# EAGLE design node (EAGLE 9.6.2)
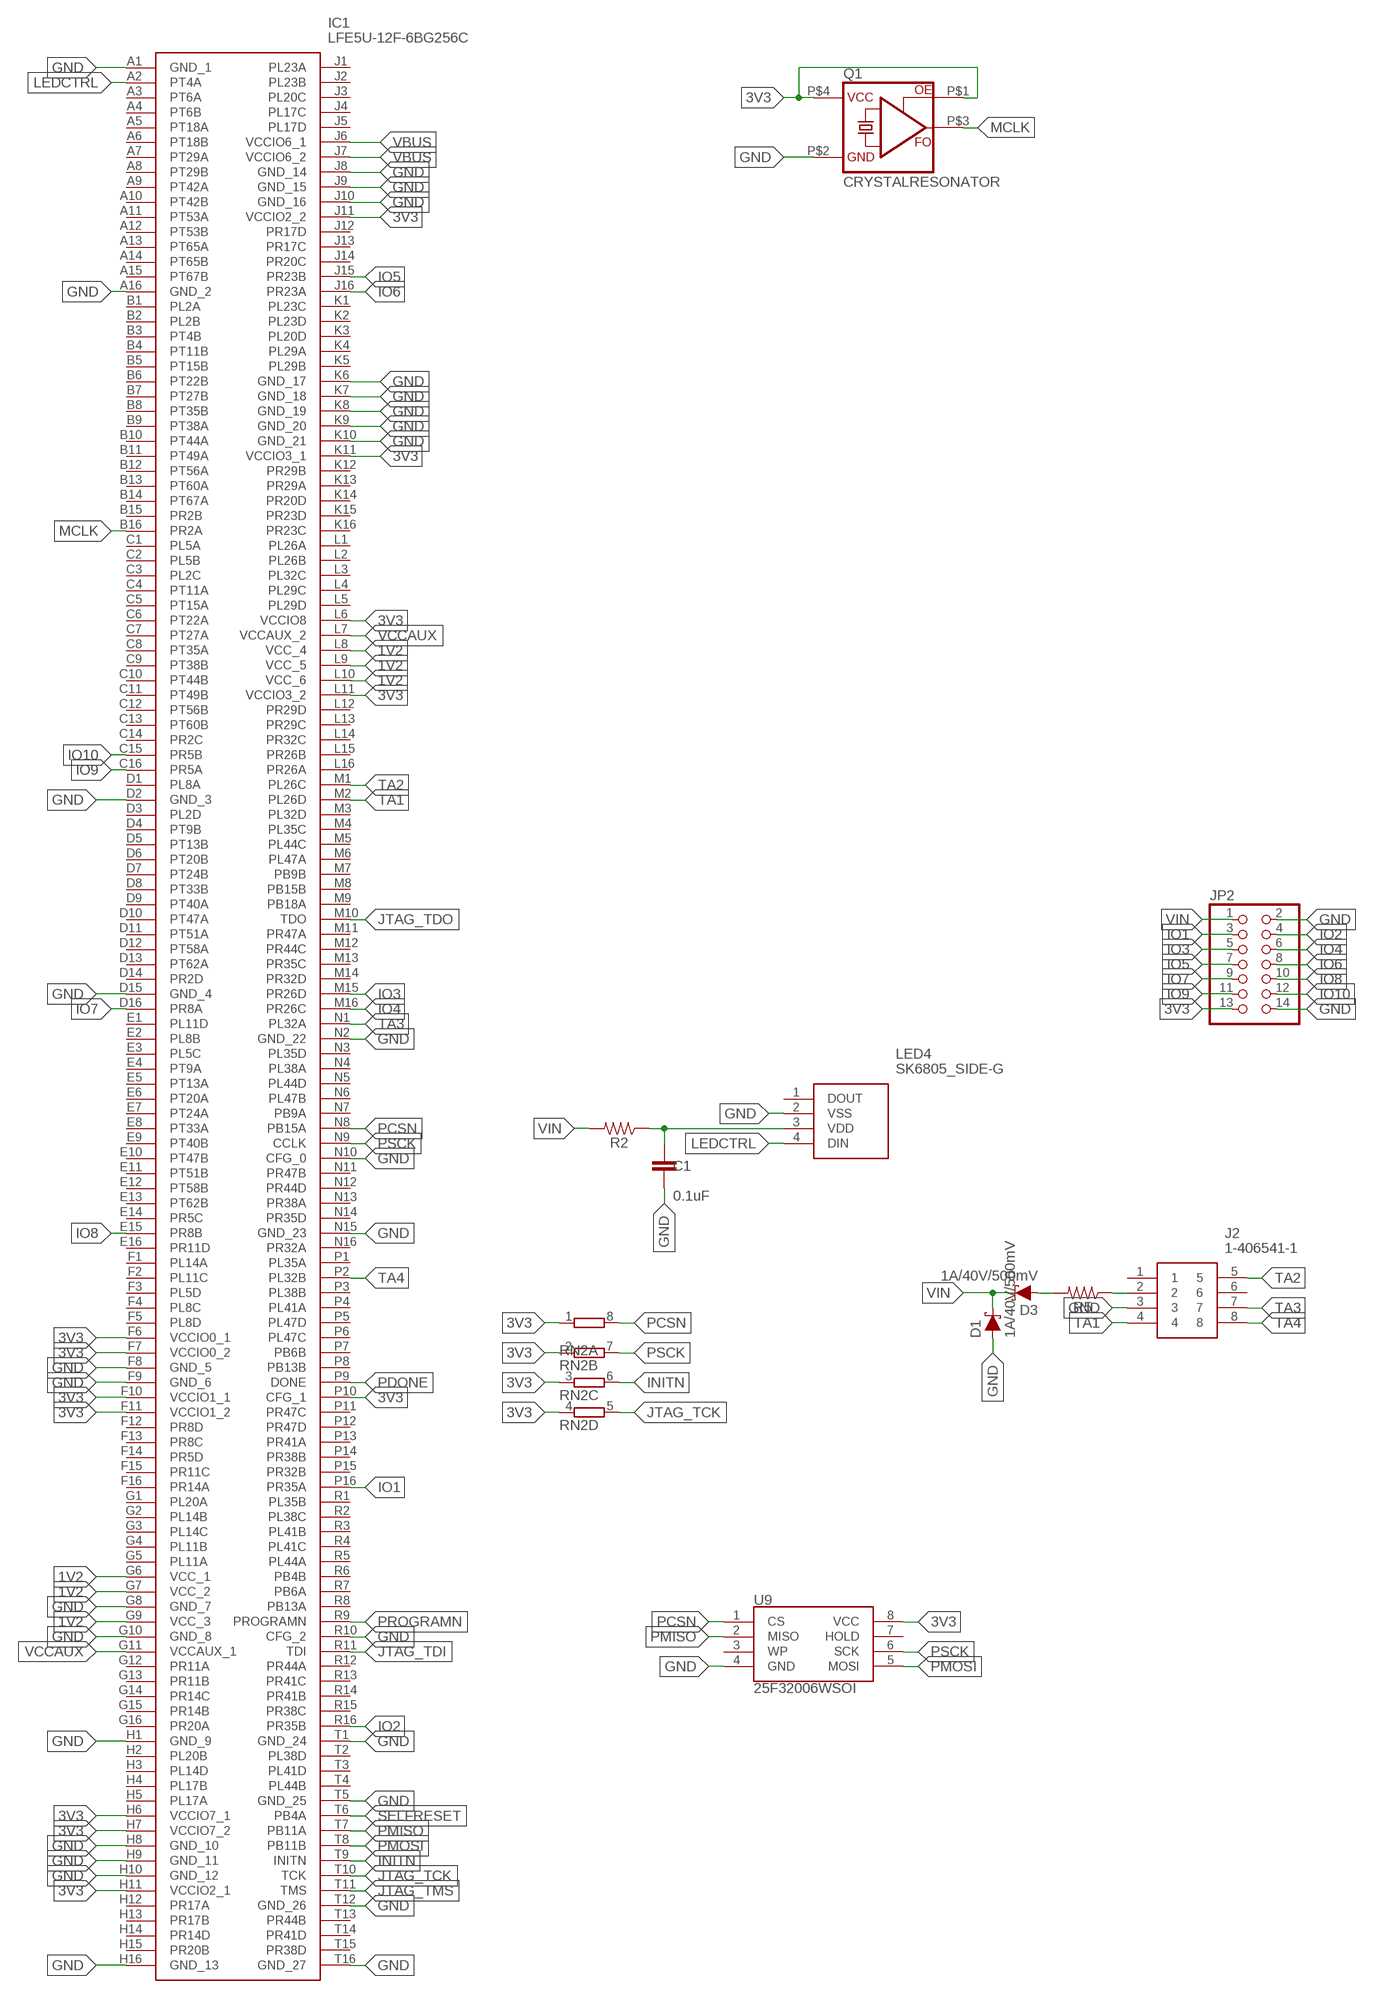
[diagram p0: schematic, sheet 1, part 1 of 2]
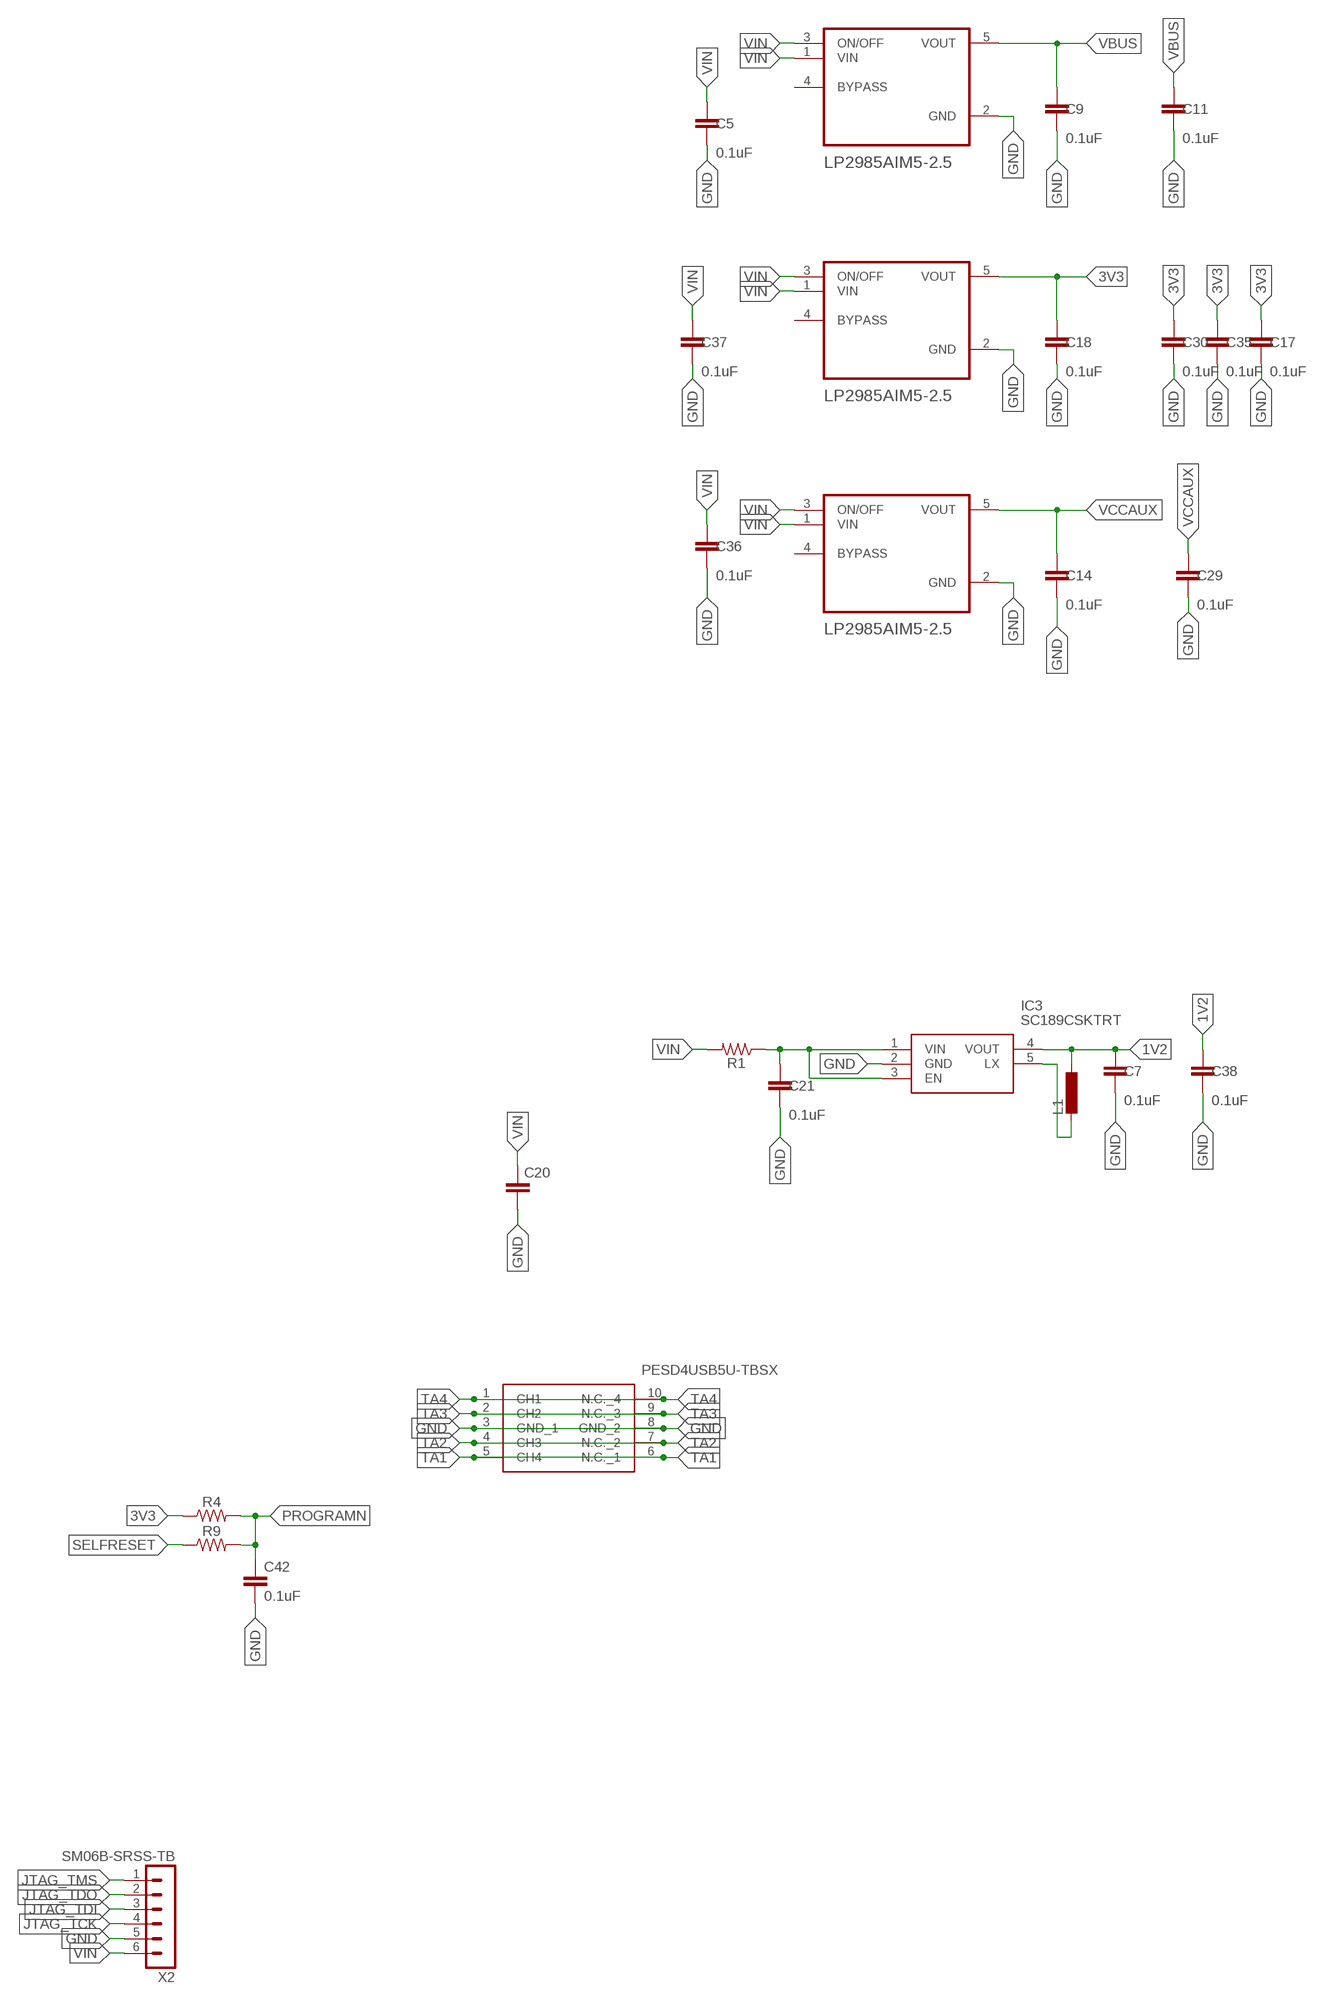
[diagram p1: schematic, sheet 1, part 2 of 2]

## Parts
C1  0.1uF  0.1UF-0603-25V-5%  [0603]
C5  0.1uF  0.1UF-0603-25V-5%  [0603]
C7  0.1uF  0.1UF-0603-25V-5%  [0603]
C9  0.1uF  0.1UF-0603-25V-5%  [0603]
C11  0.1uF  0.1UF-0603-25V-5%  [0603]
C14  0.1uF  0.1UF-0603-25V-5%  [0603]
C17  0.1uF  0.1UF-0603-25V-5%  [0603]
C18  0.1uF  0.1UF-0603-25V-5%  [0603]
C20  C-EUC1812  [C1812]
C21  0.1uF  0.1UF-0603-25V-5%  [0603]
C29  0.1uF  0.1UF-0603-25V-5%  [0603]
C30  0.1uF  0.1UF-0603-25V-5%  [0603]
C35  0.1uF  0.1UF-0603-25V-5%  [0603]
C36  0.1uF  0.1UF-0603-25V-5%  [0603]
C37  0.1uF  0.1UF-0603-25V-5%  [0603]
C38  0.1uF  0.1UF-0603-25V-5%  [0603]
C42  0.1uF  0.1UF-0603-25V-5%  [0603]
D1  1A/40V/500mV  DIODE-SCHOTTKY-SS14  [SMA-DIODE]
D3  1A/40V/500mV  DIODE-SCHOTTKY-SS14  [SMA-DIODE]
D10  PESD4USB5U-TBSX  [SON50P100X250X80-10N]
IC1  LFE5U-12F-6BG256C  [BGA256C80P16X16_1400X1400X170]
IC3  SC189CSKTRT  [SOT95P280X145-5N]
J2  1-406541-1  [1-406541-1_1]
JP2  PINHD-2X7  [2X07]
L1  L-EUL3230M  [L3230M]
LED4  SK6805_SIDE-G  [SK6805SIDEG]
Q1  CRYSTALRESONATOR  [XO53X]
R1  RESISTOR0603  [0603]
R2  RESISTOR0603  [0603]
R4  RESISTOR0603  [0603]
R5  RESISTOR0805  [0805]
R9  RESISTOR0603  [0603]
RN2  4R-NEXBV8V  [EXBV8V]
U1  LP2985AIM5-2.5  [SOT95P280X145-5N]
U2  LP2985AIM5-2.5  [SOT95P280X145-5N]
U6  LP2985AIM5-2.5  [SOT95P280X145-5N]
U9  25F32006WSOI  SPI_FLASH-X25XXSMD1  [SO08-EIAJ]
X2  SM06B-SRSS-TB  [SM06B-SRSS-TB]

## Nets
1V2: C7.1 C38.1 IC1.G6(VCC_1) IC1.G7(VCC_2) IC1.G9(VCC_3) IC1.L8(VCC_4) IC1.L9(VCC_5) IC1.L10(VCC_6) IC3.4(VOUT) L1.1
3V3: C17.1 C18.1 C30.1 C35.1 IC1.F6(VCCIO0_1) IC1.F7(VCCIO0_2) IC1.F10(VCCIO1_1) IC1.F11(VCCIO1_2) IC1.H6(VCCIO7_1) IC1.H7(VCCIO7_2) IC1.H11(VCCIO2_1) IC1.J11(VCCIO2_2) IC1.K11(VCCIO3_1) IC1.L6(VCCIO8) IC1.L11(VCCIO3_2) IC1.P10(CFG_1) JP2.13 Q1.P$1(OE) Q1.P$4(VCC) R4.1 RN2.1 RN2.2 RN2.3 RN2.4 U2.5(VOUT) U9.8(VCC)
GND: C1.2 C5.2 C7.2 C9.2 C11.2 C14.2 C17.2 C18.2 C20.2 C21.2 C29.2 C30.2 C35.2 C36.2 C37.2 C38.2 C42.2 D1.A D10.3(GND_1) D10.8(GND_2) IC1.A1(GND_1) IC1.A16(GND_2) IC1.D2(GND_3) IC1.D15(GND_4) IC1.F8(GND_5) IC1.F9(GND_6) IC1.G8(GND_7) IC1.G10(GND_8) IC1.H1(GND_9) IC1.H8(GND_10) IC1.H9(GND_11) IC1.H10(GND_12) IC1.H16(GND_13) IC1.J8(GND_14) IC1.J9(GND_15) IC1.J10(GND_16) IC1.K6(GND_17) IC1.K7(GND_18) IC1.K8(GND_19) IC1.K9(GND_20) IC1.K10(GND_21) IC1.N2(GND_22) IC1.N10(CFG_0) IC1.N15(GND_23) IC1.R10(CFG_2) IC1.T1(GND_24) IC1.T5(GND_25) IC1.T12(GND_26) IC1.T16(GND_27) IC3.2(GND) J2.3 JP2.2 JP2.14 LED4.2(VSS) Q1.P$2(GND) U1.2(GND) U2.2(GND) U6.2(GND) U9.4(GND) X2.5
INITN: IC1.T9(INITN) RN2.6
IO1: IC1.P16(PR35A) JP2.3
IO2: IC1.R16(PR35B) JP2.4
IO3: IC1.M15(PR26D) JP2.5
IO4: IC1.M16(PR26C) JP2.6
IO5: IC1.J15(PR23B) JP2.7
IO6: IC1.J16(PR23A) JP2.8
IO7: IC1.D16(PR8A) JP2.9
IO8: IC1.E15(PR8B) JP2.10
IO9: IC1.C16(PR5A) JP2.11
IO10: IC1.C15(PR5B) JP2.12
JTAG_TCK: IC1.T10(TCK) RN2.5 X2.4
JTAG_TDI: IC1.R11(TDI) X2.3
JTAG_TDO: IC1.M10(TDO) X2.2
JTAG_TMS: IC1.T11(TMS) X2.1
LEDCTRL: IC1.A2(PT4A) LED4.4(DIN)
MCLK: IC1.B16(PR2A) Q1.P$3(FO)
N$1: C1.1 LED4.3(VDD) R2.1
N$3: IC3.5(LX) L1.2
N$5: C21.1 IC3.1(VIN) IC3.3(EN) R1.1
N$6: J2.2 R5.1
N$15: D3.A R5.2
PCSN: IC1.N8(PB15A) RN2.8 U9.1(CS)
PDONE: IC1.P9(DONE)
PMISO: IC1.T7(PB11A) U9.2(MISO)
PMOSI: IC1.T8(PB11B) U9.5(MOSI)
PROGRAMN: C42.1 IC1.R9(PROGRAMN) R4.2 R9.2
PSCK: IC1.N9(CCLK) RN2.7 U9.6(SCK)
SELFRESET: IC1.T6(PB4A) R9.1
TA1: D10.5(CH4) D10.6(N.C._1) IC1.M2(PL26D) J2.4
TA2: D10.4(CH3) D10.7(N.C._2) IC1.M1(PL26C) J2.5
TA3: D10.2(CH2) D10.9(N.C._3) IC1.N1(PL32A) J2.7
TA4: D10.1(CH1) D10.10(N.C._4) IC1.P2(PL32B) J2.8
VBUS: C9.1 C11.1 IC1.J6(VCCIO6_1) IC1.J7(VCCIO6_2) U1.5(VOUT)
VCCAUX: C14.1 C29.1 IC1.G11(VCCAUX_1) IC1.L7(VCCAUX_2) U6.5(VOUT)
VIN: C5.1 C20.1 C36.1 C37.1 D1.C D3.C JP2.1 R1.2 R2.2 U1.1(VIN) U1.3(ON/OFF) U2.1(VIN) U2.3(ON/OFF) U6.1(VIN) U6.3(ON/OFF) X2.6
Unconnected: IC1.A3(PT6A) IC1.A4(PT6B) IC1.A5(PT18A) IC1.A6(PT18B) IC1.A7(PT29A) IC1.A8(PT29B) IC1.A9(PT42A) IC1.A10(PT42B) IC1.A11(PT53A) IC1.A12(PT53B) IC1.A13(PT65A) IC1.A14(PT65B) IC1.A15(PT67B) IC1.B1(PL2A) IC1.B2(PL2B) IC1.B3(PT4B) IC1.B4(PT11B) IC1.B5(PT15B) IC1.B6(PT22B) IC1.B7(PT27B) IC1.B8(PT35B) IC1.B9(PT38A) IC1.B10(PT44A) IC1.B11(PT49A) IC1.B12(PT56A) IC1.B13(PT60A) IC1.B14(PT67A) IC1.B15(PR2B) IC1.C1(PL5A) IC1.C2(PL5B) IC1.C3(PL2C) IC1.C4(PT11A) IC1.C5(PT15A) IC1.C6(PT22A) IC1.C7(PT27A) IC1.C8(PT35A) IC1.C9(PT38B) IC1.C10(PT44B) IC1.C11(PT49B) IC1.C12(PT56B) IC1.C13(PT60B) IC1.C14(PR2C) IC1.D1(PL8A) IC1.D3(PL2D) IC1.D4(PT9B) IC1.D5(PT13B) IC1.D6(PT20B) IC1.D7(PT24B) IC1.D8(PT33B) IC1.D9(PT40A) IC1.D10(PT47A) IC1.D11(PT51A) IC1.D12(PT58A) IC1.D13(PT62A) IC1.D14(PR2D) IC1.E1(PL11D) IC1.E2(PL8B) IC1.E3(PL5C) IC1.E4(PT9A) IC1.E5(PT13A) IC1.E6(PT20A) IC1.E7(PT24A) IC1.E8(PT33A) IC1.E9(PT40B) IC1.E10(PT47B) IC1.E11(PT51B) IC1.E12(PT58B) IC1.E13(PT62B) IC1.E14(PR5C) IC1.E16(PR11D) IC1.F1(PL14A) IC1.F2(PL11C) IC1.F3(PL5D) IC1.F4(PL8C) IC1.F5(PL8D) IC1.F12(PR8D) IC1.F13(PR8C) IC1.F14(PR5D) IC1.F15(PR11C) IC1.F16(PR14A) IC1.G1(PL20A) IC1.G2(PL14B) IC1.G3(PL14C) IC1.G4(PL11B) IC1.G5(PL11A) IC1.G12(PR11A) IC1.G13(PR11B) IC1.G14(PR14C) IC1.G15(PR14B) IC1.G16(PR20A) IC1.H2(PL20B) IC1.H3(PL14D) IC1.H4(PL17B) IC1.H5(PL17A) IC1.H12(PR17A) IC1.H13(PR17B) IC1.H14(PR14D) IC1.H15(PR20B) IC1.J1(PL23A) IC1.J2(PL23B) IC1.J3(PL20C) IC1.J4(PL17C) IC1.J5(PL17D) IC1.J12(PR17D) IC1.J13(PR17C) IC1.J14(PR20C) IC1.K1(PL23C) IC1.K2(PL23D) IC1.K3(PL20D) IC1.K4(PL29A) IC1.K5(PL29B) IC1.K12(PR29B) IC1.K13(PR29A) IC1.K14(PR20D) IC1.K15(PR23D) IC1.K16(PR23C) IC1.L1(PL26A) IC1.L2(PL26B) IC1.L3(PL32C) IC1.L4(PL29C) IC1.L5(PL29D) IC1.L12(PR29D) IC1.L13(PR29C) IC1.L14(PR32C) IC1.L15(PR26B) IC1.L16(PR26A) IC1.M3(PL32D) IC1.M4(PL35C) IC1.M5(PL44C) IC1.M6(PL47A) IC1.M7(PB9B) IC1.M8(PB15B) IC1.M9(PB18A) IC1.M11(PR47A) IC1.M12(PR44C) IC1.M13(PR35C) IC1.M14(PR32D) IC1.N3(PL35D) IC1.N4(PL38A) IC1.N5(PL44D) IC1.N6(PL47B) IC1.N7(PB9A) IC1.N11(PR47B) IC1.N12(PR44D) IC1.N13(PR38A) IC1.N14(PR35D) IC1.N16(PR32A) IC1.P1(PL35A) IC1.P3(PL38B) IC1.P4(PL41A) IC1.P5(PL47D) IC1.P6(PL47C) IC1.P7(PB6B) IC1.P8(PB13B) IC1.P11(PR47C) IC1.P12(PR47D) IC1.P13(PR41A) IC1.P14(PR38B) IC1.P15(PR32B) IC1.R1(PL35B) IC1.R2(PL38C) IC1.R3(PL41B) IC1.R4(PL41C) IC1.R5(PL44A) IC1.R6(PB4B) IC1.R7(PB6A) IC1.R8(PB13A) IC1.R12(PR44A) IC1.R13(PR41C) IC1.R14(PR41B) IC1.R15(PR38C) IC1.T2(PL38D) IC1.T3(PL41D) IC1.T4(PL44B) IC1.T13(PR44B) IC1.T14(PR41D) IC1.T15(PR38D) J2.1 J2.6 LED4.1(DOUT) U1.4(BYPASS) U2.4(BYPASS) U6.4(BYPASS) U9.3(WP) U9.7(HOLD)

## Library data of the parts
C1 C5 C7 C9 C11 C14 C17 C18 C21 C29 C30 C35-C38 C42 = SparkFun-Capacitors:0.1UF: 0.1µF ceramic capacitors A capacitor is a passive two-terminal electrical component used to store electrical energy temporarily in an electric field.; PROD_ID: CAP-08604
C20 = rcl:C-EU: CAPACITOR, European symbol; SPICEPREFIX: C
D1 D3 = SparkFun-DiscreteSemi:DIODE-SCHOTTKY: Schottky diode A Schottky diode is a semiconductor diode which has a low forward voltage drop and a very fast switching action.; PROD_ID: DIO-08053
D10 = PESD4USB5U-TBSX:PESD4USB5U-TBSX: ESD Suppressors / TVS Diodes TVS DIODES Source: Datasheet <https://assets.nexperia.com/documents/data-sheet/PESD4USB5U-TBS.pdf>; DESCRIPTION: ESD Suppressors / TVS Diodes TVS DIODES; HEIGHT: 0.8mm; MANUFACTURER_NAME: Nexperia; MANUFACTURER_PART_NUMBER: PESD4USB5U-TBSX; MOUSER_PART_NUMBER: 771-PESD4USB5U-TBSX; MOUSER_PRICE-STOCK: https://www.mouser.co.uk/ProductDetail/Nexperia/PESD4USB5U-TBSX?qs=ljCeji4nMDmlBRiGiyUt1A%3D%3D
IC1 = LFE5U-12F-6BG256C:LFE5U-12F-6BG256C: FPGA - Field Programmable Gate Array ECP5; 12k LUTs; 1.1V Source: Datasheet <http://www.latticesemi.com/-/media/LatticeSemi/Documents/DataSheets/ECP5/FPGA-DS-02012-1-9-ECP5-ECP5G-Family-Data-Sheet.ashx?document_id=50461> Check prices <https://pricing.snapeda.com/parts/LFE5U-12F-6BG256C/Lattice%20Semiconductor/view-part?ref=eda>; AVAILABILITY: Warning; DESCRIPTION: ECP5 Field Programmable Gate Array (FPGA) IC 197 589824 12000 256-LFBGA; MF: Lattice Semiconductor; MP: LFE5U-12F-6BG256C; PACKAGE: CABGA-256 Lattice Semiconductor; PRICE: None; PURCHASE-URL: https://pricing.snapeda.com/search/part/LFE5U-12F-6BG256C/?ref=eda
IC3 = SC189CSKTRT:SC189CSKTRT: Conv DC-DC 2.9V to 5.5V Synchronous Step Down Single-Out 1.2V 1.5A 6-Pin MLPD-UT T/R Source: Datasheet <https://datasheet.datasheetarchive.com/originals/distributors/Datasheets-DGA14/1272982.pdf>; ARROW_PART_NUMBER: SC189CSKTRT; ARROW_PRICE-STOCK: https://www.arrow.com/en/products/sc189csktrt/semtech; DESCRIPTION: Conv DC-DC 2.9V to 5.5V Synchronous Step Down Single-Out 1.2V 1.5A 6-Pin MLPD-UT T/R; HEIGHT: 1.45mm; MANUFACTURER_NAME: SEMTECH; MANUFACTURER_PART_NUMBER: SC189CSKTRT; MOUSER_PART_NUMBER: 947-SC189CSKTRT; MOUSER_PRICE-STOCK: https://www.mouser.co.uk/ProductDetail/Semtech/SC189CSKTRT?qs=rBWM4%252BvDhIcKNVCFfiXT%2Fw%3D%3D
J2 = 1-406541-1:1-406541-1: ModJack,RightAngle,8Position,Cat5 TE Connectivity Female Cat5 RJ45 Connector, Right Angle, Through Hole Mount, Source: Datasheet <http://uk.rs-online.com/web/p/products/7820823>; ARROW_PART_NUMBER: 1-406541-1; ARROW_PRICE-STOCK: https://www.arrow.com/en/products/1-406541-1/te-connectivity?region=europe; DESCRIPTION: ModJack,RightAngle,8Position,Cat5 TE Connectivity Female Cat5 RJ45 Connector, Right Angle, Through Hole Mount,; HEIGHT: mm; MANUFACTURER_NAME: TE Connectivity; MANUFACTURER_PART_NUMBER: 1-406541-1; MOUSER_PART_NUMBER: 571-1-406541-1; MOUSER_PRICE-STOCK: https://www.mouser.co.uk/ProductDetail/TE-Connectivity/1-406541-1?qs=dOAuEKQrqY4XW9msRoSnqA%3D%3D
JP2 = pinhead:PINHD-2X7: PIN HEADER
L1 = rcl:L-EU: INDUCTOR, European symbol; SPICEPREFIX: L
LED4 = SK6805_SIDE-G:SK6805_SIDE-G: SIDE-G 3512 LED Source: Datasheet <https://drive.google.com/file/d/14zRGkHF65mb-kswuIYE0wuO3upQk3szr/view?usp=sharing>; DESCRIPTION: SIDE-G 3512 LED; HEIGHT: 1.3mm; MANUFACTURER_NAME: Shenzhen Normand Electronic; MANUFACTURER_PART_NUMBER: SK6805 SIDE-G
Q1 = Crystals-new:CRYSTALRESONATOR
R1 R2 R4 R5 R9 = SparkFun-Resistors:RESISTOR: Generic Resistor Package
RN2 = resistor-dil:4R-N: Array Chip Resistor Source: RS Component / Phycomp; OC_FARNELL: unknown; OC_NEWARK: unknown
U1 U2 U6 = LP2985AIM5-2.5:LP2985AIM5-2.5: Check prices <https://pricing.snapeda.com/parts/LP2985AIM5-2.5/NOPB/Texas%20Instruments/view-part?ref=eda>; AVAILABILITY: In Stock; DESCRIPTION: 150-mA, 16-V, low-dropout voltage regulator with enable 5-SOT-23 -40 to 125; MF: Texas Instruments; MP: LP2985AIM5-2.5/NOPB; PACKAGE: SOT-23-5 Texas Instruments; PRICE: None; PURCHASE-URL: https://pricing.snapeda.com/search/part/LP2985AIM5-2.5/NOPB/?ref=eda
U9 = SparkFun-IC-Memory:SPI_FLASH-X25XX: 32M Serial Flash Memory 8pin SPI Flash series x25xx. Works with devices like W25X32 and BR25L32 Datasheet <http://www.macronix.com/Lists/Datasheet/Attachments/5031/MX25L3206E,%203V,%2032Mb,%20v1.5.pdf> SparkFun Products SparkFun Venus GPS Logger <https://www.sparkfun.com/products/10920> (GPS-10920); PROD_ID: IC-09109
X2 = con-JST SH (2):SM06B-SRSS: JST SH series header 1.00mm pitch disconnectable crimp style connectors, horizontal (side entry type), 6 pins

## Board
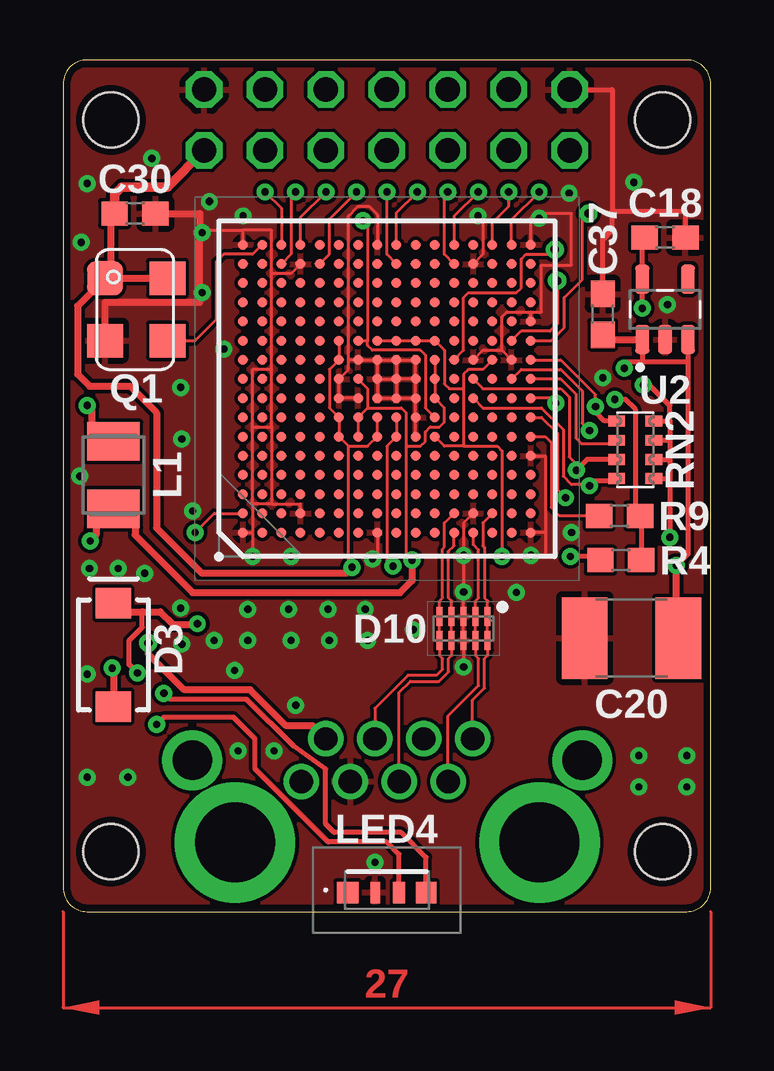
[diagram p2: board, top side]
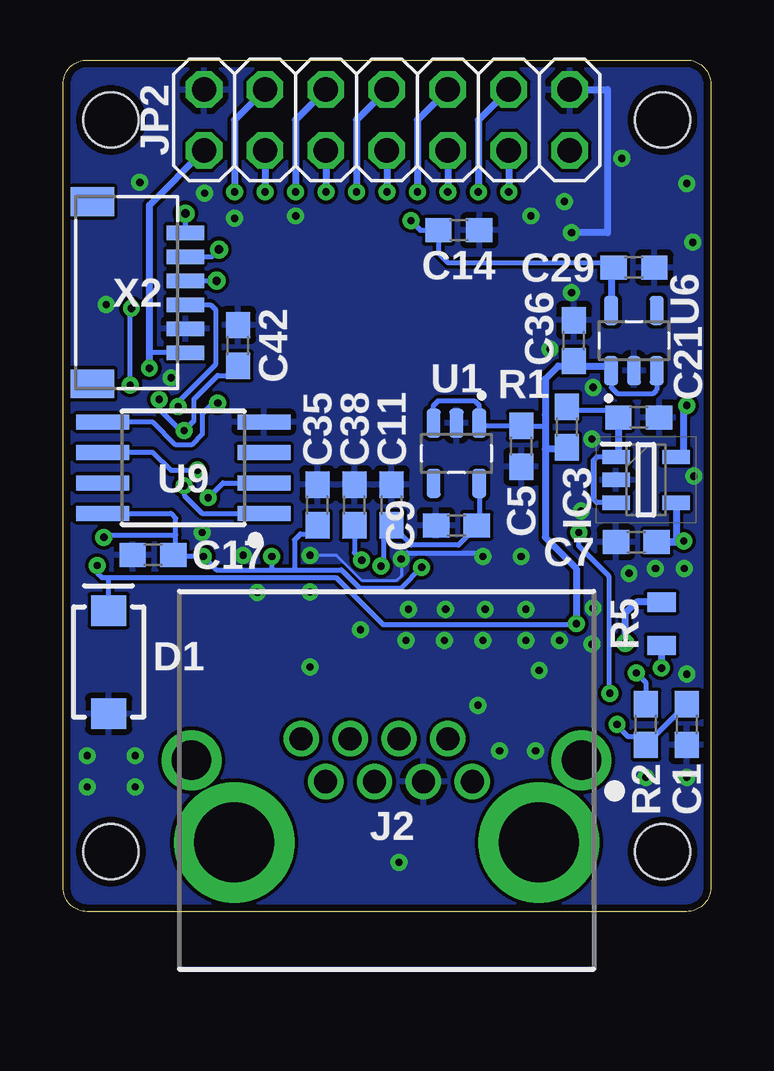
[diagram p3: board, bottom side, seen from below]

Size 27 x 35.5 mm. Coordinates in mm from the lower left corner, seen from the top.
Outline: 27,1 27,34.5 arc90 26,35.5 1,35.5 arc90 0,34.5 0,1 arc90 1,0 26,0 arc90 27,1
Copper layers (1*16): Top 0.035mm / dielectric 1.5mm / Bottom 0.035mm
Design rules "default *": minimum track width 0.125mm, minimum drill 0.3mm, track to track 0.125mm, track to pad 0.125mm, pad to pad 0.125mm, via to via 0.125mm, smd to smd 0mil, copper to edge 0.3mm, drill to drill 0.25mm, minimum pad ring 10mil, minimum via ring 8mil, stop-mask expansion 4mil, vias tented up to drill 4mm, thermal gap 10mil
Holes 2.3 mm at 25,2.5 2,2.5 25,33 2,33

### Footprints (pad centres in the part's own frame; a part is rotated, then mirrored left to right if it is on the bottom)
0603 = smd 1.1 x 1: 1 -0.85,0; 2 0.85,0
C1812 = smd 1.9 x 3.4: 1 -1.95,0; 2 1.95,0
SMA-DIODE = smd 1.27 x 1.47: A -2.15,0; C 2.15,0
SON50P100X250X80-10N = smd 0.8 x 0.25: 1 -0.5,1; 2 -0.5,0.5; 3 -0.5,0; 4 -0.5,-0.5; 5 -0.5,-1; 6 0.5,-1; 7 0.5,-0.5; 8 0.5,0; 9 0.5,0.5; 10 0.5,1
BGA256C80P16X16_1400X1400X170 = smd 0.41 x 0.41: A1 -6,6; A2 -5.2,6; A3 -4.4,6; A4 -3.6,6; A5 -2.8,6; A6 -2,6; A7 -1.2,6; A8 -0.4,6; A9 0.4,6; A10 1.2,6; A11 2,6; A12 2.8,6; A13 3.6,6; A14 4.4,6; A15 5.2,6; A16 6,6; B1 -6,5.2; B2 -5.2,5.2; B3 -4.4,5.2; B4 -3.6,5.2; B5 -2.8,5.2; B6 -2,5.2; B7 -1.2,5.2; B8 -0.4,5.2; B9 0.4,5.2; B10 1.2,5.2; B11 2,5.2; B12 2.8,5.2; B13 3.6,5.2; B14 4.4,5.2; B15 5.2,5.2; B16 6,5.2; C1 -6,4.4; C2 -5.2,4.4; C3 -4.4,4.4; C4 -3.6,4.4; C5 -2.8,4.4; C6 -2,4.4; C7 -1.2,4.4; C8 -0.4,4.4; C9 0.4,4.4; C10 1.2,4.4; C11 2,4.4; C12 2.8,4.4; C13 3.6,4.4; C14 4.4,4.4; C15 5.2,4.4; C16 6,4.4; D1 -6,3.6; D2 -5.2,3.6; D3 -4.4,3.6; D4 -3.6,3.6; D5 -2.8,3.6; D6 -2,3.6; D7 -1.2,3.6; D8 -0.4,3.6; D9 0.4,3.6; D10 1.2,3.6; D11 2,3.6; D12 2.8,3.6; D13 3.6,3.6; D14 4.4,3.6; D15 5.2,3.6; D16 6,3.6; E1 -6,2.8; E2 -5.2,2.8; E3 -4.4,2.8; E4 -3.6,2.8; E5 -2.8,2.8; E6 -2,2.8; E7 -1.2,2.8; E8 -0.4,2.8; E9 0.4,2.8; E10 1.2,2.8; E11 2,2.8; E12 2.8,2.8; E13 3.6,2.8; E14 4.4,2.8; E15 5.2,2.8; E16 6,2.8; F1 -6,2; F2 -5.2,2; F3 -4.4,2; F4 -3.6,2; F5 -2.8,2; F6 -2,2; F7 -1.2,2; F8 -0.4,2; F9 0.4,2; F10 1.2,2; F11 2,2; F12 2.8,2; F13 3.6,2; F14 4.4,2; F15 5.2,2; F16 6,2; G1 -6,1.2; G2 -5.2,1.2; G3 -4.4,1.2; G4 -3.6,1.2; G5 -2.8,1.2; G6 -2,1.2; G7 -1.2,1.2; G8 -0.4,1.2; G9 0.4,1.2; G10 1.2,1.2; G11 2,1.2; G12 2.8,1.2; G13 3.6,1.2; G14 4.4,1.2; G15 5.2,1.2; G16 6,1.2; H1 -6,0.4; H2 -5.2,0.4; H3 -4.4,0.4; H4 -3.6,0.4; H5 -2.8,0.4; H6 -2,0.4; H7 -1.2,0.4; H8 -0.4,0.4; H9 0.4,0.4; H10 1.2,0.4; H11 2,0.4; H12 2.8,0.4; H13 3.6,0.4; H14 4.4,0.4; H15 5.2,0.4; H16 6,0.4; J1 -6,-0.4; J2 -5.2,-0.4; J3 -4.4,-0.4; J4 -3.6,-0.4; J5 -2.8,-0.4; J6 -2,-0.4; J7 -1.2,-0.4; J8 -0.4,-0.4; J9 0.4,-0.4; J10 1.2,-0.4; J11 2,-0.4; J12 2.8,-0.4; J13 3.6,-0.4; J14 4.4,-0.4; J15 5.2,-0.4; J16 6,-0.4; K1 -6,-1.2; K2 -5.2,-1.2; K3 -4.4,-1.2; K4 -3.6,-1.2; K5 -2.8,-1.2; K6 -2,-1.2; K7 -1.2,-1.2; K8 -0.4,-1.2; K9 0.4,-1.2; K10 1.2,-1.2; K11 2,-1.2; K12 2.8,-1.2; K13 3.6,-1.2; K14 4.4,-1.2; K15 5.2,-1.2; K16 6,-1.2; L1 -6,-2; L2 -5.2,-2; L3 -4.4,-2; L4 -3.6,-2; L5 -2.8,-2; L6 -2,-2; L7 -1.2,-2; L8 -0.4,-2; L9 0.4,-2; L10 1.2,-2; L11 2,-2; L12 2.8,-2; L13 3.6,-2; L14 4.4,-2; L15 5.2,-2; L16 6,-2; M1 -6,-2.8; M2 -5.2,-2.8; M3 -4.4,-2.8; M4 -3.6,-2.8; M5 -2.8,-2.8; M6 -2,-2.8; M7 -1.2,-2.8; M8 -0.4,-2.8; M9 0.4,-2.8; M10 1.2,-2.8; M11 2,-2.8; M12 2.8,-2.8; M13 3.6,-2.8; M14 4.4,-2.8; M15 5.2,-2.8; M16 6,-2.8; N1 -6,-3.6; N2 -5.2,-3.6; N3 -4.4,-3.6; N4 -3.6,-3.6; N5 -2.8,-3.6; N6 -2,-3.6; N7 -1.2,-3.6; N8 -0.4,-3.6; N9 0.4,-3.6; N10 1.2,-3.6; N11 2,-3.6; N12 2.8,-3.6; N13 3.6,-3.6; N14 4.4,-3.6; N15 5.2,-3.6; N16 6,-3.6; P1 -6,-4.4; P2 -5.2,-4.4; P3 -4.4,-4.4; P4 -3.6,-4.4; P5 -2.8,-4.4; P6 -2,-4.4; P7 -1.2,-4.4; P8 -0.4,-4.4; P9 0.4,-4.4; P10 1.2,-4.4; P11 2,-4.4; P12 2.8,-4.4; P13 3.6,-4.4; P14 4.4,-4.4; P15 5.2,-4.4; P16 6,-4.4; R1 -6,-5.2; R2 -5.2,-5.2; R3 -4.4,-5.2; R4 -3.6,-5.2; R5 -2.8,-5.2; R6 -2,-5.2; R7 -1.2,-5.2; R8 -0.4,-5.2; R9 0.4,-5.2; R10 1.2,-5.2; R11 2,-5.2; R12 2.8,-5.2; R13 3.6,-5.2; R14 4.4,-5.2; R15 5.2,-5.2; R16 6,-5.2; T1 -6,-6; T2 -5.2,-6; T3 -4.4,-6; T4 -3.6,-6; T5 -2.8,-6; T6 -2,-6; T7 -1.2,-6; T8 -0.4,-6; T9 0.4,-6; T10 1.2,-6; T11 2,-6; T12 2.8,-6; T13 3.6,-6; T14 4.4,-6; T15 5.2,-6; T16 6,-6
SOT95P280X145-5N = smd 1.15 x 0.6: 1 -1.25,0.95; 2 -1.25,0; 3 -1.25,-0.95; 4 1.25,-0.95; 5 1.25,0.95
1-406541-1_1 = drill 0.97 pad 1.47: 1 12.215,7.82; 2 11.195,9.6; 3 10.175,7.82; 4 9.155,9.6; 5 8.135,7.82; 6 7.115,9.6; 7 6.095,7.82; 8 5.075,9.6 | drill 3.33 pad 5.03: 9 2.285,5.28; 10 14.985,5.28 | drill 1.65 pad 2.5: 11 16.765,8.71; 12 0.505,8.71
2X07 = drill 1.016 octagon: 1 -7.62,-1.27; 2 -7.62,1.27; 3 -5.08,-1.27; 4 -5.08,1.27; 5 -2.54,-1.27; 6 -2.54,1.27; 7 0,-1.27; 8 0,1.27; 9 2.54,-1.27; 10 2.54,1.27; 11 5.08,-1.27; 12 5.08,1.27; 13 7.62,-1.27; 14 7.62,1.27
L3230M = smd 1.6 x 2.2: 1 -1.4,0; 2 1.4,0
SK6805SIDEG = smd 0.9 x 0.9: 1 -1.638,-0.1 | smd 0.4 x 0.9: 2 -0.488,-0.1 | smd 0.5 x 0.9: 3 0.512,-0.1 | smd 0.85 x 0.9: 4 1.637,-0.1
XO53X = smd 1.4 x 1.5: P$1 -1.3,-1.25; P$2 1.3,-1.25; P$3 1.3,1.35; P$4 -1.3,1.35
0805 = smd 0.8 x 1.2: 1 -0.9,0; 2 0.9,0
EXBV8V = smd 0.45 x 0.7: 1 -1.2,-0.775; 2 -0.4,-0.775; 3 0.4,-0.775; 4 1.2,-0.775; 5 1.2,0.775; 6 0.4,0.775; 7 -0.4,0.775; 8 -1.2,0.775
SOT95P280X145-5N' = smd 1.21 x 0.59: 1 -1.255,0.95; 2 -1.255,0; 3 -1.255,-0.95; 4 1.255,-0.95; 5 1.255,0.95
SO08-EIAJ = smd 0.61 x 2.21: 1 -1.905,-3.378; 2 -0.635,-3.378; 3 0.635,-3.378; 4 1.905,-3.378; 5 1.905,3.353; 6 0.635,3.353; 7 -0.635,3.353; 8 -1.905,3.353
SM06B-SRSS-TB = smd 0.6 x 1.55: 1 2.5,0; 2 1.5,0; 3 0.5,0; 4 -0.5,0; 5 -1.5,0; 6 -2.5,0 | smd 1.2 x 1.8: M1 3.8,3.875; M2 -3.8,3.875

### Placement (x,y rotation side)
C1  1,7.8 270 bottom
C5  7.9,19.4 270 bottom
C7  3.1,15.4 180 bottom
C9  10.6,16.1 180 bottom
C11  13.3,16.95 90 bottom
C14  10.5,28.4 0 bottom
C17  23.25,14.88 180 bottom
C18  25.1,28.1 0 top
C20  23.7,11.4 180 top
C21  3,20.6 0 bottom
C29  3.2,26.85 0 bottom
C30  3,29.1 0 top
C35  16.4,16.95 90 bottom
C36  5.7,23.8 90 bottom
C37  22.5,24.9 90 top
C38  14.85,16.95 90 bottom
C42  19.7,23.6 90 bottom
D1  25.1,10.4 90 bottom
D3  2.1,10.7 90 top
D10  16.7,11.8 270 top
IC1  13.5,21.8 90 top
IC3  2.7,18 0 bottom
J2  22.15,-2.4 0 bottom
JP2  13.5,33 0 bottom
L1  2.1,18.2 90 top
LED4  13.5,0.9 0 top
Q1  3,25.1 270 top
R1  6,20.2 270 bottom
R2  2.7,7.8 90 bottom
R4  23.25,14.65 0 top
R5  2.05,12 270 bottom
R9  23.2,16.5 0 top
RN2  23.85,19.25 90 top
U1  LP2985AIM5-2.5  [SOT95P280X145-5N']  10.6,19.1 270 bottom
U2  LP2985AIM5-2.5  [SOT95P280X145-5N']  25.1,25.1 90 top
U6  LP2985AIM5-2.5  [SOT95P280X145-5N']  3.2,23.8 90 bottom
U9  22,18.5 90 bottom
X2  21.9,25.8 90 bottom

### Tracks (layer width: path | path; a pad name or v marks a point on that pad's centre or on a via)
1V2  (via drill 0.3)
  Top 0.125: IC1.G9 12.7,21.8 12.7,21 | 12.7,21 IC1.G7 IC1.G6 | 12.7,21 14.1,21 14.3,20.8 14.3,19.4 | IC1.L10 IC1.L9 IC1.L8 15.9,21 15.9,20.4 15.7,20.2 15.3,20.2 15.1,20 15.1,19.6 14.9,19.4 14.3,19.4 | 14.3,19.4 14.3,14.9 v14.55,14.65
  Top 0.3: v1.12,15.45 1.38,15.7 1.38,16.8 L1.1 3,16.8 3,15.7 5.4,13.3 14.05,13.3 14.55,13.8 v14.55,14.65
  Bottom 0.2: C38.1 14.85,14.95 v14.55,14.65
  Bottom 0.3: IC3.4 1.43,17.02 1.43,15.4 C7.1 1.18,15.4 v1.12,15.45
3V3  (via drill 0.3)
  Top 0.125: IC1.H11 IC1.J11 IC1.K11 IC1.L11 15.9,23.4 15.9,22 16.1,21.8 16.7,21.8 | IC1.F11 IC1.F10 11.1,22.6 11.1,21 IC1.F7 IC1.F6 11.9,19.4 | IC1.H7 IC1.H6 12.7,19.4 11.9,19.4 | IC1.L6 15.9,19.4 16.7,19.4 | IC1.P10 17.5,22.6 16.9,22.6 16.7,22.4 16.7,21.8 | 16.7,21.8 16.7,19.4 | v12.05,14.35 11.9,14.35 11.9,19.4 | 16.7,19.4 18.1,19.4 18.3,19.2 v18.3,14.8 | 22.3,14.8 22.3,14.75 R4.1
  Top 0.2: 22.3,14.8 v21.15,14.8 | C18.1 24.15,28 U2.5 v24.15,25.15 | 25.3,20.45 25.3,21.1 24.45,21.95 v24.2,21.95 | 25.3,19.65 25.3,18.85 | 25.3,18.85 25.3,18.05 | 25.3,18.05 v25.3,15.6 | RN2.4 25.3,20.45 | 25.3,20.45 25.3,19.65 | RN2.3 25.3,19.65 | RN2.2 25.3,18.85 | RN2.1 25.3,18.05
  Top 0.3: C30.1 2,29.1 2,26.4 Q1.P$1 | Q1.P$1 Q1.P$4 | Q1.P$1 0.6,25.25 0.6,22.4 1.1,21.9 2.8,21.9 3.9,20.8 3.9,16 5.8,14.1 11.8,14.1 v12.05,14.35
  Top 0.4: C30.1 2.15,29.9 2.45,30.2 4.35,30.2 JP2.13
  Bottom 0.2: U9.8 22.5,16.59 22.3,16.39 22.3,15.7 | 18.3,14.25 20.6,14.25 v21.15,14.8 22.4,14.8 C17.1 22.3,14.98 22.3,15.7 | 18.3,14.25 17.35,14.25 | 17.35,14.25 15.4,14.25 14.65,13.5 12.9,13.5 v12.05,14.35 | v25.3,15.6 25.2,15.7 22.3,15.7 | v18.3,14.8 18.3,14.25 | v24.2,21.95 24.2,25.1 v24.15,25.15 | C35.1 16.4,15.75 17.1,15.75 17.35,15.5 17.35,14.25
GND  (via drill 0.3)
  Top 0.125: IC1.D15 9.5,26.6 8.7,26.6 | IC1.H10 IC1.G10 11.9,23 | IC1.H9 IC1.H8 IC1.J8 | IC1.G8 IC1.F8 IC1.F9 11.9,22.6 11.9,23 | IC1.H9 IC1.J9 | IC1.J9 IC1.J8 | IC1.J8 IC1.K8 | IC1.K8 IC1.K9 | IC1.K8 IC1.K7 IC1.K6 | 7.5,28.4 8.7,28.4 8.7,26.6 | IC1.A16 7.5,28.4 | IC1.D2 9.9,17 8.7,17 | 7.9,17 7.9,15.8 | 8.7,17 7.9,17 | 7.9,20.2 8.7,20.2 | 8.7,20.2 8.7,22.6 | 8.7,22.6 8.7,26.6 | 8.7,20.2 8.7,17 | 7.9,17 7.9,20.2 | 8.7,22.6 7.9,22.6 7.9,20.2 | IC1.A1 7.9,15.8 | 7.9,15.8 v7.9,14.8 | IC1.N15 17.5,27.4 17.5,28.8 v17.3,29 | IC1.H10 IC1.J10 | IC1.K9 IC1.K10 IC1.J10 | IC1.K9 IC1.J9 | IC1.J10 IC1.J9 | IC1.H9 IC1.H10 | IC1.N2 16.7,16.2 v16.7,13.32 D10.3 D10.8 v16.7,10.2 | IC1.N10 17.5,23.4 18.3,23.4 | 18.3,23.4 IC1.R10 | 18.3,23.4 18.3,24.8 18.5,25 19.5,25 | IC1.T12 19.5,25 | IC1.T16 19.5,28.9 v19.85,28.9 20.05,29.1 21.2,29.1 21.2,26.95 19.95,26.95 19.95,25 19.5,25 | 5.7,28.4 7.5,28.4 | IC1.T5 20.1,19 20.1,15.8 | 20.1,15.8 IC1.T1 | 20.1,15.8 20.1,14.85 v19.5,14.85 | 11.9,23 11.9,29 12.3,29.4 12.75,29.4 13.1,29.05 IC1.H16 | IC1.H1 13.1,14.9 v12.9,14.7
  Top 0.2: C37.2 22.5,28 22.9,28.4 22.9,29.2 | 22.9,29.2 25.95,29.2 C18.2 | JP2.2 22.9,34.27 22.9,29.2
  Top 0.3: Q1.P$2 1.75,25.4 5.7,25.4 5.7,28.4 5.7,29.1 C30.2
  Bottom 0.125: v12.9,14.7 12.9,14 13.11,13.79 14.53,13.79 15.59,14.85 v16.7,14.85
  Bottom 0.2: v12.9,14.7 12.65,14.95 9.65,14.95 v9.5,14.8 9.55,14.85
  Bottom 0.3: JP2.14 4.3,34.27 4.3,28.3 v5.8,28.3
  other vias: 18.9,13.3 5.8,25.8 6.7,23.45 4.9,21.85 7.7,12.6 9.4,12.6 12.6,12.6 6.3,11.3 7.7,11.3 9.5,11.3 12.7,11.3 7.5,29 6.1,29.6 3.7,31.4 0.75,27.9 1,30.35 23.8,30.4 21.1,29.95 25.2,25.3 26,6.5 24,6.5 24,5.2 26,5.2 4.9,12.65 3.4,14.1 1.1,14.3 5.4,16.7 21.2,15.8 0.7,18.15 22.5,22.25 2.3,14.3 4.95,11.15 14.6,11.75 11.1,11.3 11.05,12.6 13,2.05 7.15,10.05 9.7,8.6 4.95,19.7 1,9.9 1,5.6 2.7,5.6 8.8,6.7 7.3,6.7
  pour Bottom (isolate 0.15, rank 3): -4.5,37 31.5,37 31.5,-1 -4.5,-1
  pour Top (isolate 0.15): -5.5,38 32.5,38 32.5,-2 -5.5,-2
INITN
  Top 0.125: RN2.6 22.92,19.5 21.62,19.5 21.38,19.75 21.38,21.57 20.75,22.2 IC1.T9
IO1  (via drill 0.3)
  Top 0.125: IC1.P16 17.9,28.72 18.58,29.4 v18.58,30
  Bottom 0.3: JP2.3 v18.58,30
IO2  (via drill 0.3)
  Top 0.125: IC1.R16 18.7,28.85 v19.85,30
  Bottom 0.3: JP2.4 19.85,33 v19.85,30
IO3  (via drill 0.3)
  Top 0.125: IC1.M15 15.9,27.4 15.9,29.86 v16.04,30
  Bottom 0.3: JP2.5 v16.04,30
IO4  (via drill 0.3)
  Top 0.125: v17.31,30 16.3,28.99 IC1.M16
  Bottom 0.3: JP2.6 17.31,33 v17.31,30
IO5  (via drill 0.3)
  Top 0.125: IC1.J15 13.5,27.4 v13.5,30
  Bottom 0.3: JP2.7 v13.5,30
IO6  (via drill 0.3)
  Top 0.125: IC1.J16 13.9,29.13 v14.77,30
  Bottom 0.3: JP2.8 14.77,33 v14.77,30
IO7  (via drill 0.3)
  Top 0.125: IC1.D16 9.9,28.94 v10.96,30
  Bottom 0.3: JP2.9 v10.96,30
IO8  (via drill 0.3)
  Top 0.125: IC1.E15 11.1,27.4 11.1,28.87 v12.23,30
  Bottom 0.3: JP2.10 12.23,33 v12.23,30
IO9  (via drill 0.3)
  Top 0.125: v8.42,30 9.1,29.32 IC1.C16
  Bottom 0.3: JP2.11 v8.42,30
IO10  (via drill 0.3)
  Top 0.125: v9.69,30 9.5,29.81 9.5,27.4 IC1.C15
  Bottom 0.3: JP2.12 9.69,33 v9.69,30
JTAG_TCK  (via drill 0.3)
  Top 0.125: IC1.T10 20.75,23 22.2,21.55 v22.2,21.05 22.23,21.02
  Top 0.2: RN2.5 22.58,20.45 22.23,20.8 22.23,21.02
  Bottom 0.2: X2.4 20.85,25.3 20.65,25.1 20.65,22.8 22.2,21.25 v22.2,21.05
JTAG_TDI  (via drill 0.35)
  Top 0.125: v20.6,26.3 20.6,24.49 20.3,24.19 19.09,24.19 IC1.R11
  Bottom 0.2: X2.3 v20.6,26.3
JTAG_TDO  (via drill 0.35)
  Top 0.125: IC1.M10 16.7,23.4 16.7,25.6 16.9,25.8 18.9,25.8 19.1,26 19.1,27.2 19.3,27.4 20.3,27.4 v20.5,27.6
  Bottom 0.2: X2.2 20.8,27.3 v20.5,27.6
JTAG_TMS  (via drill 0.35)
  Top 0.125: v21.9,29.1 21.65,28.85 21.65,26.35 20.9,25.6 20.9,24.35 20.35,23.8 IC1.T11
  Bottom 0.2: X2.1 v21.9,29.1
LEDCTRL  (via drill 0.3)
  Top 0.125: v5.5,15.8 6.3,16.6 IC1.A2
  Top 0.2: LED4.4 15.14,2.26 14.1,3.3 11.3,3.3 10.95,3.65 10.95,5.94 9.6,6.9 7.65,8.85 4.45,8.85 v4.2,9.1
  Bottom 0.2: v4.2,9.1 4.25,9.15 4.25,14 5.5,15.25 v5.5,15.8
MCLK
  Top 0.125: IC1.B16 7.9,27.4 6.7,27.4 6.4,27.1 6.4,24.7 5.5,23.8 Q1.P$3
N$1  (via drill 0.3)
  Top 0.2: LED4.3 14.01,2.39 13.5,2.9 11.05,2.9 8,5.95 8,7.2 7.1,8.1 4.2,8.1 v3.9,7.8
  Bottom 0.2: v3.9,7.8 3.9,7.75 3.45,7.3 2.7,7.3 R2.1 C1.1
N$3  (via drill 0.3)
  Top 0.3: L1.2 1.2,19.6 1.2,20.9 v1,21.1
  Bottom 0.3: v1,21.1 1.15,20.95 1.15,18.95 IC3.5
N$5
  Bottom 0.2: IC3.1 4.75,18.95 4.9,18.8 4.9,17.2 4.75,17.05 IC3.3 | C21.1 4.15,20.9 5.85,20.9 R1.1
  Bottom 0.3: C21.1 3.85,19.05 IC3.1
N$6  (via drill 0.35)
  Top 0.3: v3.55,11.2 3.55,10.75 5.05,9.25 7.8,9.25 9.3,7.75 10.41,7.75 J2.2
  Bottom 0.3: v3.55,11.2 3.55,12.45 3.1,12.9 R5.1
N$15  (via drill 0.3)
  Top 0.3: v2.05,10.15 2.1,10.1 D3.A
  Bottom 0.3: R5.2 v2.05,10.15
PCSN  (via drill 0.3)
  Top 0.125: IC1.N8 17.5,21 19.95,21 20.85,20.1 20.85,18.15 21.2,17.8 21.8,17.8 | v21.95,17.75 21.95,17.8 21.95,17.95
  Top 0.2: RN2.8 22.98,17.95 21.95,17.95 | 21.95,17.8 21.8,17.8
  Bottom 0.2: v21.95,17.75 21.95,17.35 21.2,16.59 U9.1
PMISO  (via drill 0.3)
  Top 0.125: v20.95,17.25 20.6,17.6 20.6,19.95 19.95,20.6 IC1.T7
  Bottom 0.2: v20.95,17.25 20.34,17.86 U9.2
PMOSI  (via drill 0.3)
  Top 0.125: v20.55,21.2 20.35,21.4 IC1.T8
  Bottom 0.2: v20.55,21.2 20.75,21.2 21.2,20.75 21.2,19.9 21.65,19.45 22.3,19.45 23.26,20.41 U9.5
PROGRAMN  (via drill 0.3)
  Top 0.125: IC1.R9 19.1,22.6 20.75,22.6 21.65,21.7 21.65,20.35 v21.95,20.05
  Top 0.2: v23,21.35 23.45,21.35 23.85,20.95 23.85,16.7 R9.2 24.1,16.45 R4.2
  Bottom 0.2: v23,21.35 23,20.95 22.1,20.05 v21.95,20.05 21.55,20.45 21.55,21.35 20.55,22.35 19.7,22.35 C42.1
PSCK  (via drill 0.3)
  Top 0.125: IC1.N9 17.5,21.8 20.75,21.8 21.1,21.45 21.1,18.95 21.4,18.65 v21.4,18.4
  Top 0.2: RN2.7 21.85,18.85 v21.4,18.4
  Bottom 0.2: U9.6 23.23,19.14 22.5,18.4 v21.4,18.4
SELFRESET
  Top 0.125: IC1.T6 20.1,19.8 20.35,19.55 20.35,16.85 20.7,16.5 R9.1
TA1
  Top 0.125: IC1.M2 15.9,16.2 15.9,15.2 15.82,15.12 15.82,13.07 15.7,12.95 D10.5 D10.6 15.7,10.68 15.82,10.55 15.82,10.1 15.57,9.85 14.38,9.85 13,8.47 J2.4
TA2
  Top 0.125: IC1.M1 16.3,15.25 16.07,15.02 16.07,13.07 16.2,12.95 D10.4 D10.7 16.2,10.68 16.07,10.55 16.07,10 15.68,9.6 14.48,9.6 14.02,9.14 J2.5
TA3
  Top 0.125: IC1.N1 17.1,15.3 17.32,15.07 17.32,13.07 17.2,12.95 D10.2 D10.9 17.2,10.68 17.32,10.55 17.32,9.43 16.05,8.16 J2.7
TA4
  Top 0.125: IC1.P2 17.5,16.2 17.5,15.25 17.57,15.18 17.57,13.07 17.7,12.95 D10.1 D10.10 17.7,10.68 17.57,10.55 17.57,9.32 17.07,8.82 J2.8
VBUS  (via drill 0.3)
  Top 0.125: IC1.J7 IC1.J6 13.5,19.4 13.5,14.65 v13.75,14.4
  Bottom 0.2: v13.75,14.4 13.65,14.5 13.65,15.75 C11.1 12.48,15.27 10.52,15.27 9.75,16.05 C9.1 9.65,16.2 U1.5
VCCAUX  (via drill 0.3)
  Top 0.125: IC1.L7 15.1,21 15.1,23.2 14.9,23.4 12.9,23.4 12.7,23.6 12.7,23.8 | 12.7,23.8 12.7,28.6 v12.5,28.8 | IC1.G11 12.7,23.8
  Bottom 0.2: v12.5,28.8 12.1,28.4 C14.1 11.35,27.45 10.95,27.05 4.25,27.05 C29.1
  Bottom 0.3: C29.1 4.15,26.75 U6.5
VIN  (via drill 0.3)
  Top 0.2: U2.1 24.15,22.9 | U2.3 26.05,22.9 | 26.05,22.9 24.15,22.9 | 24.15,22.9 23.4,22.9 v23.4,22.65 | 26.05,22.9 26.05,14.9 v25.58,14.43 | D3.C 2.1,12.5 | v3.1,9.95 2.75,10.3 2.75,11.3 3.3,11.85 3.3,12.5
  Top 0.3: 2.1,12.5 3.3,12.5 4.05,12.5 4.6,11.95 5.55,11.95 v5.6,12 | C37.1 22.7,23.84 U2.1 | C20.1 25.58,11.48 v25.58,14.43
  Bottom 0.2: U6.3 2.25,21.75 2.4,21.6 3.9,21.6 4.15,21.85 U6.1 | v25.58,14.43 25.58,14.12 25.38,13.93 25.1,13.93 | 25.1,13.93 15.62,13.93 13.65,11.95 5.65,11.95 v5.6,12 | D1.C 25.1,13.93 | X2.6 23.4,23.3 | 6.9,20.7 6.9,20.25 C5.1 9.55,20.25 U1.1 9.65,21.1 9.85,21.3 11.35,21.3 11.55,21.1 U1.3 | R2.2 2.7,9.55 v3.1,9.95
  Bottom 0.3: U6.1 4.15,22.75 5.7,22.75 C36.1 5.9,22.75 6.35,22.75 6.9,22.2 6.9,20.7 6.9,19.27 | 6.9,19.27 6.1,19.27 6.02,19.35 R1.2 | v23.4,22.65 23.4,23.3 23.4,29.45 JP2.1 | 6.9,19.27 6.9,15.6 5.6,14.3 v5.6,12
(copper drawn outside any net)
  shapes: Top area x1